# Altium schematic sheet MCU.SchDoc
size A4
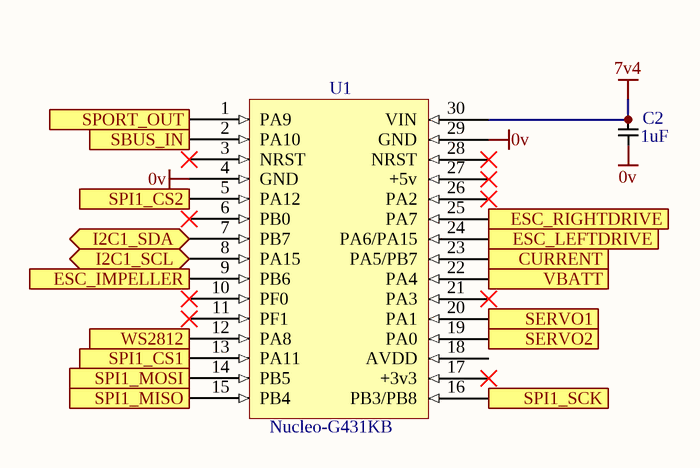
[diagram p0: MCU.SchDoc]

## Parts
C2  1uF  [0805]
U1  Nucleo-G431KB  [nucleo]

## Ports
CURRENT (in), ESC_IMPELLER (out), ESC_LEFTDRIVE (out), ESC_RIGHTDRIVE (out), I2C1_SCL (bidir), I2C1_SDA (bidir), SBUS_IN (in), SERVO1 (out), SERVO2 (out), SPI1_CS1 (out), SPI1_CS2 (out), SPI1_MISO (in), SPI1_MOSI (out), SPI1_SCK (out), SPORT_OUT (out), VBATT (in), WS2812 (out)

## Nets
0v: C2.2 U1.4(GND) U1.29(GND)
7v4: C2.1 U1.30(VIN)
CURRENT: U1.23(PA5/PB7) ; port CURRENT
ESC_IMPELLER: U1.9(PB6) ; port ESC_IMPELLER
ESC_LEFTDRIVE: U1.24(PA6/PA15) ; port ESC_LEFTDRIVE
ESC_RIGHTDRIVE: U1.25(PA7) ; port ESC_RIGHTDRIVE
I2C1_SCL: U1.8(PA15) ; port I2C1_SCL
I2C1_SDA: U1.7(PB7) ; port I2C1_SDA
SBUS_IN: U1.2(PA10) ; port SBUS_IN
SERVO1: U1.20(PA1) ; port SERVO1
SERVO2: U1.19(PA0) ; port SERVO2
SPI1_CS1: U1.13(PA11) ; port SPI1_CS1
SPI1_CS2: U1.5(PA12) ; port SPI1_CS2
SPI1_MISO: U1.15(PB4) ; port SPI1_MISO
SPI1_MOSI: U1.14(PB5) ; port SPI1_MOSI
SPI1_SCK: U1.16(PB3/PB8) ; port SPI1_SCK
SPORT_OUT: U1.1(PA9) ; port SPORT_OUT
VBATT: U1.22(PA4) ; port VBATT
WS2812: U1.12(PA8) ; port WS2812

Not connected (* = marked no-connect by the designer): U1 3(NRST)* 6(PB0)* 10(PF0)* 11(PF1)* 17(+3v3)* 18(AVDD) 21(PA3)* 26(PA2)* 27(+5v)* 28(NRST)*

## Library data of the parts
C2 = Capacitor